# Altium project Prj_PLC_Hieu.PrjPcb
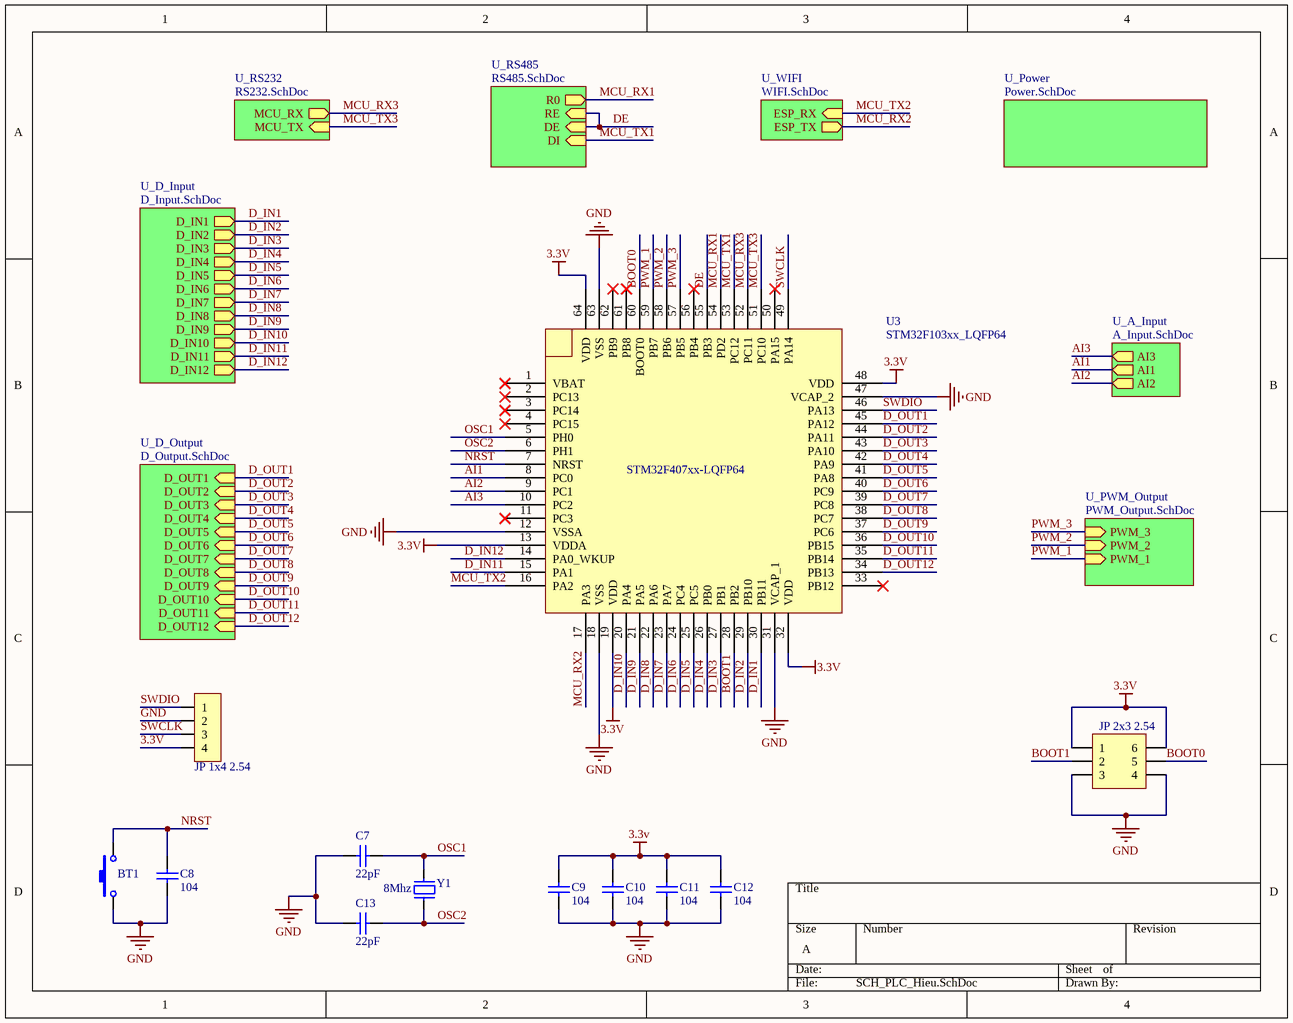
[diagram p0: SCH_PLC_Hieu.SchDoc]
7 sheets, 161 parts. Net scope: hierarchical (ports join the sheet entries above them; power ports are global).
Board file: PCB1.PcbDoc
Sheets:
  SCH_PLC_Hieu.SchDoc
    U_D_Input = D_Input.SchDoc
    U_D_Output = D_Output.SchDoc
    U_RS232 = RS232.SchDoc
    U_RS485 = RS485.SchDoc
    U_Power = Power.SchDoc
    U_PWM_Output = PWM_Output.SchDoc

## Sheet SCH_PLC_Hieu.SchDoc
size A; SheetNumber: 1; SheetTotal: 9

### Parts
BT1  Nut Nhan 2 Chan SMD 3x6x2.5  [Nut Nhan 2 Chan SMD 3x6x2.5]  (value not drawn)
C7  22pF  [tu 0805]
C8  104  [tu 0805]
C9  104  [tu 0805]
C10  104  [tu 0805]
C11  104  [tu 0805]
C12  104  [tu 0805]
C13  22pF  [tu 0805]
JP1  JP 2x3 2.54  [JP 2x3 DT]
JP2  JP 1x4 2.54  [JP 1x4 DT]
U3  STM32F103xx_LQFP64  [STM32_LQFP64]
Y1  8Mhz  [Thach Anh 2 chan SMD]

### Sub-sheets
U_A_Input = A_Input.SchDoc (file not in this document): AI3 (out), AI1 (out), AI2 (out)
U_D_Input = D_Input.SchDoc: D_IN12 (out), D_IN7 (out), D_IN4 (out), D_IN2 (out), D_IN9 (out), D_IN8 (out), D_IN11 (out), D_IN3 (out), D_IN5 (out), D_IN1 (out), D_IN10 (out), D_IN6 (out)
U_D_Output = D_Output.SchDoc: D_OUT9 (in), D_OUT8 (in), D_OUT4 (in), D_OUT7 (in), D_OUT12 (in), D_OUT5 (in), D_OUT2 (in), D_OUT11 (in), D_OUT10 (in), D_OUT6 (in), D_OUT1 (in), D_OUT3 (in)
U_Power = Power.SchDoc: no entries
U_PWM_Output = PWM_Output.SchDoc: PWM_3 (in), PWM_2 (in), PWM_1 (in)
U_RS232 = RS232.SchDoc: MCU_RX (out), MCU_TX (in)
U_RS485 = RS485.SchDoc: R0 (out), RE (in), DE (in), DI (in)
U_WIFI = WIFI.SchDoc (file not in this document): ESP_TX (out), ESP_RX (in)

### Nets
3.3V: C9.2 C10.2 C11.1 C12.2 JP1.1 JP1.6 JP2.4 U3.13(VDDA) U3.19(VDD) U3.32(VDD) U3.48(VDD) U3.64(VDD)
GND: BT1.1 C7.1 C8.2 C9.1 C10.1 C11.2 C12.1 C13.1 JP1.3 JP1.4 JP2.2 U3.12(VSSA) U3.18(VSS) U3.31(VCAP_1) U3.47(VCAP_2) U3.63(VSS)
AI1: U3.8(PC0) ; sheet U_A_Input/AI1
AI2: U3.9(PC1) ; sheet U_A_Input/AI2
AI3: U3.10(PC2) ; sheet U_A_Input/AI3
BOOT0: JP1.5 U3.60(BOOT0)
BOOT1: JP1.2 U3.28(PB2)
D_IN1: U3.30(PB11) ; sheet U_D_Input/D_IN1
D_IN2: U3.29(PB10) ; sheet U_D_Input/D_IN2
D_IN3: U3.27(PB1) ; sheet U_D_Input/D_IN3
D_IN4: U3.26(PB0) ; sheet U_D_Input/D_IN4
D_IN5: U3.25(PC5) ; sheet U_D_Input/D_IN5
D_IN6: U3.24(PC4) ; sheet U_D_Input/D_IN6
D_IN7: U3.23(PA7) ; sheet U_D_Input/D_IN7
D_IN8: U3.22(PA6) ; sheet U_D_Input/D_IN8
D_IN9: U3.21(PA5) ; sheet U_D_Input/D_IN9
D_IN10: U3.20(PA4) ; sheet U_D_Input/D_IN10
D_IN11: U3.15(PA1) ; sheet U_D_Input/D_IN11
D_IN12: U3.14(PA0_WKUP) ; sheet U_D_Input/D_IN12
D_OUT1: U3.45(PA12) ; sheet U_D_Output/D_OUT1
D_OUT2: U3.44(PA11) ; sheet U_D_Output/D_OUT2
D_OUT3: U3.43(PA10) ; sheet U_D_Output/D_OUT3
D_OUT4: U3.42(PA9) ; sheet U_D_Output/D_OUT4
D_OUT5: U3.41(PA8) ; sheet U_D_Output/D_OUT5
D_OUT6: U3.40(PC9) ; sheet U_D_Output/D_OUT6
D_OUT7: U3.39(PC8) ; sheet U_D_Output/D_OUT7
D_OUT8: U3.38(PC7) ; sheet U_D_Output/D_OUT8
D_OUT9: U3.37(PC6) ; sheet U_D_Output/D_OUT9
D_OUT10: U3.36(PB15) ; sheet U_D_Output/D_OUT10
D_OUT11: U3.35(PB14) ; sheet U_D_Output/D_OUT11
D_OUT12: U3.34(PB13) ; sheet U_D_Output/D_OUT12
DE: U3.55(PB3) ; sheet U_RS485/RE, sheet U_RS485/DE
MCU_RX1: U3.54(PD2) ; sheet U_RS485/R0
MCU_RX2: U3.17(PA3) ; sheet U_WIFI/ESP_TX
MCU_RX3: U3.52(PC11) ; sheet U_RS232/MCU_RX
MCU_TX1: U3.53(PC12) ; sheet U_RS485/DI
MCU_TX2: U3.16(PA2) ; sheet U_WIFI/ESP_RX
MCU_TX3: U3.51(PC10) ; sheet U_RS232/MCU_TX
NRST: BT1.2 C8.1 U3.7(NRST)
OSC1: C7.2 U3.5(PH0) Y1.2
OSC2: C13.2 U3.6(PH1) Y1.1
PWM_1: U3.59(PB7) ; sheet U_PWM_Output/PWM_1
PWM_2: U3.58(PB6) ; sheet U_PWM_Output/PWM_2
PWM_3: U3.57(PB5) ; sheet U_PWM_Output/PWM_3
SWCLK: JP2.3 U3.49(PA14)
SWDIO: JP2.1 U3.46(PA13)

Not connected (* = marked no-connect by the designer): U3 1(VBAT)* 2(PC13)* 3(PC14)* 4(PC15)* 11(PC3)* 33(PB12)* 50(PA15)* 56(PB4)* 61(PB8)* 62(PB9)*

### Notes on the sheet
- (in symbol STM32F103xx_LQFP64) STM32F407xx-LQFP64

### Library data of the parts
BT1 = Nut Nhan 2 Chan SMD 3x6x2.5: Ma_Hang: MH001036; Ten: Nút Nhấn 2 Chân 3x6x2.5MM SMD
C7 C13 = Tu 0805 22pF 50V 10%: Dán; Don_Vi: Con; So_Chan: 2; Ten_Linh_Kien: Tụ 0805 22P 10% 50V; Ma_Hang: MH004560; Chung_Loai: Dán; Kieu_Chan: *
C8-C12 = Tu 0805 104 50V 10%: Dán; Don_Vi: Con; So_Chan: 2; Ten_Linh_Kien: Tụ 0805 104-100nF 10% 50V; Ma_Hang: MH004551; Chung_Loai: Dán; Kieu_Chan: *
JP1 = JP 2x3 2.54 Duc Thang: Cắm; Ten_Linh_Kien: Jump Đôi Đực 2.54MM 2x40P Thẳng 11MM; Don_Vi: Con; Ma_Hang: MH002686; Ghi_Chu: *; Kieu_Chan: *; Chung_Loai: Cắm
JP2 = JP 1x4 2.54 Duc Thang: Cắm; Ten_Linh_Kien: Jump Đơn Đực 2.54MM 1x40P Thẳng 11MM; Don_Vi: Con; Ma_Hang: MH000903; Ghi_Chu: *; Kieu_Chan: *; Chung_Loai: Cắm
Y1 = Thach Anh 2 chan SMD: Crystal For all Crystal 2pin.; Value: 4Mhz

## Sheet D_Input.SchDoc
size A; SheetNumber: 4; SheetTotal: 9
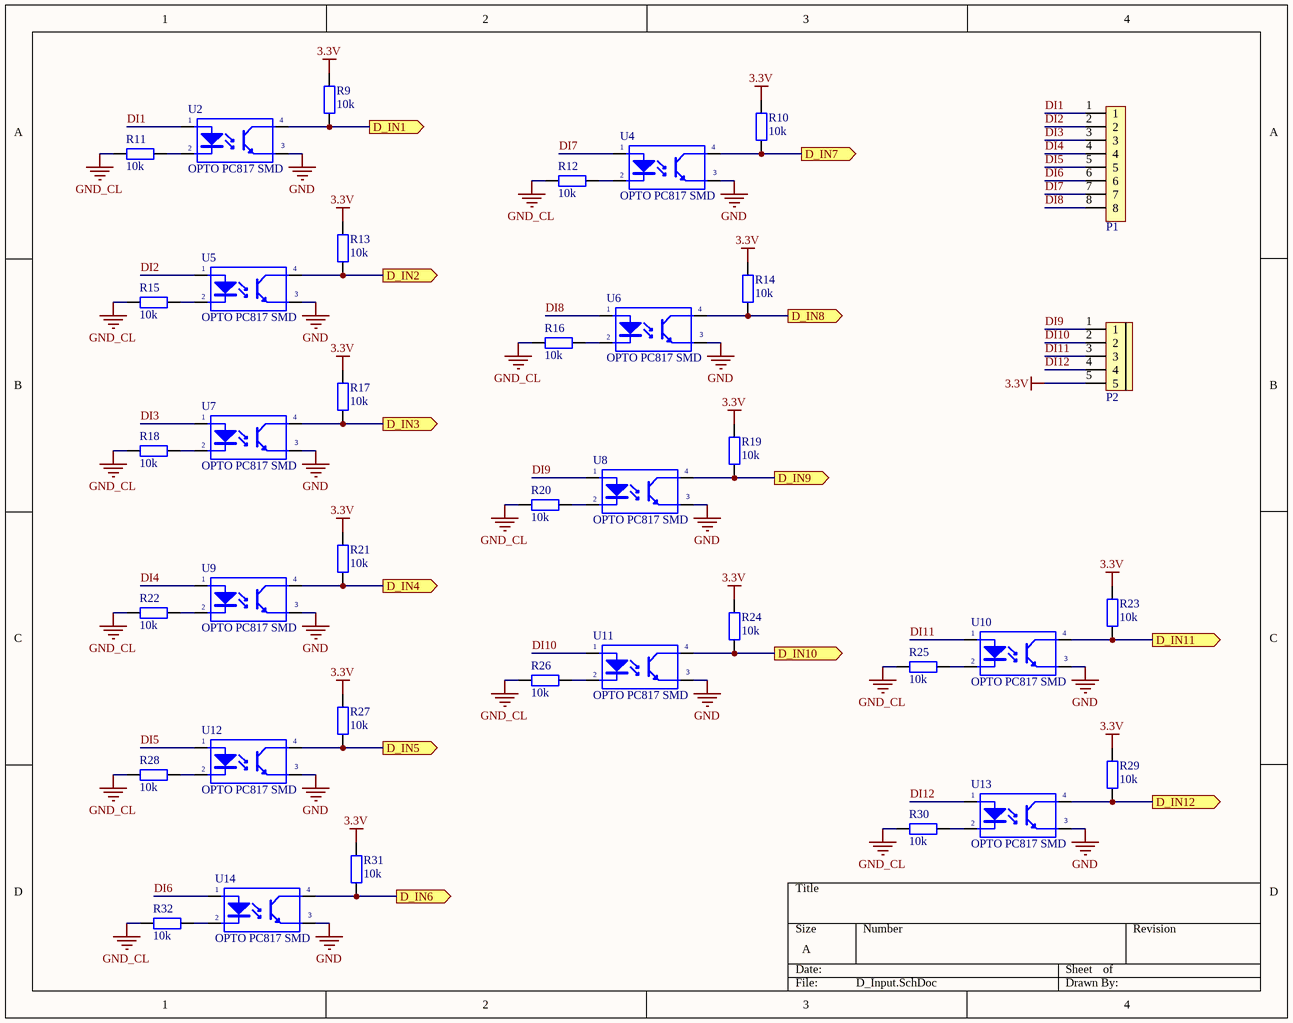
[diagram p1: D_Input.SchDoc]

### Parts
P1  CON 8 EDG5.08  [CON 8 8EDG5.08]  (value not drawn)
P2  CON 5 EDG5.08  [CON 5 5EDG5.08]  (value not drawn)
R9  10k  [tro smd 0805]
R10  10k  [tro smd 0805]
R11  10k  [tro smd 0805]
R12  10k  [tro smd 0805]
R13  10k  [tro smd 0805]
R14  10k  [tro smd 0805]
R15  10k  [tro smd 0805]
R16  10k  [tro smd 0805]
R17  10k  [tro smd 0805]
R18  10k  [tro smd 0805]
R19  10k  [tro smd 0805]
R20  10k  [tro smd 0805]
R21  10k  [tro smd 0805]
R22  10k  [tro smd 0805]
R23  10k  [tro smd 0805]
R24  10k  [tro smd 0805]
R25  10k  [tro smd 0805]
R26  10k  [tro smd 0805]
R27  10k  [tro smd 0805]
R28  10k  [tro smd 0805]
R29  10k  [tro smd 0805]
R30  10k  [tro smd 0805]
R31  10k  [tro smd 0805]
R32  10k  [tro smd 0805]
U2  OPTO PC817 SMD  [SOP4]
U4  OPTO PC817 SMD  [SOP4]
U5  OPTO PC817 SMD  [SOP4]
U6  OPTO PC817 SMD  [SOP4]
U7  OPTO PC817 SMD  [SOP4]
U8  OPTO PC817 SMD  [SOP4]
U9  OPTO PC817 SMD  [SOP4]
U10  OPTO PC817 SMD  [SOP4]
U11  OPTO PC817 SMD  [SOP4]
U12  OPTO PC817 SMD  [SOP4]
U13  OPTO PC817 SMD  [SOP4]
U14  OPTO PC817 SMD  [SOP4]

### Ports
D_IN1 (out), D_IN2 (out), D_IN3 (out), D_IN4 (out), D_IN5 (out), D_IN6 (out), D_IN7 (out), D_IN8 (out), D_IN9 (out), D_IN10 (out), D_IN11 (out), D_IN12 (out)

### Nets
3.3V: P2.5 R9.2 R10.2 R13.2 R14.2 R17.2 R19.2 R21.2 R23.2 R24.2 R27.2 R29.2 R31.2
GND: U2.3(E) U4.3(E) U5.3(E) U6.3(E) U7.3(E) U8.3(E) U9.3(E) U10.3(E) U11.3(E) U12.3(E) U13.3(E) U14.3(E)
GND_CL: R11.1 R12.1 R15.1 R16.1 R18.1 R20.1 R22.1 R25.1 R26.1 R28.1 R30.1 R32.1
D_IN1: R9.1 U2.4(C) ; port D_IN1
D_IN2: R13.1 U5.4(C) ; port D_IN2
D_IN3: R17.1 U7.4(C) ; port D_IN3
D_IN4: R21.1 U9.4(C) ; port D_IN4
D_IN5: R27.1 U12.4(C) ; port D_IN5
D_IN6: R31.1 U14.4(C) ; port D_IN6
D_IN7: R10.1 U4.4(C) ; port D_IN7
D_IN8: R14.1 U6.4(C) ; port D_IN8
D_IN9: R19.1 U8.4(C) ; port D_IN9
D_IN10: R24.1 U11.4(C) ; port D_IN10
D_IN11: R23.1 U10.4(C) ; port D_IN11
D_IN12: R29.1 U13.4(C) ; port D_IN12
DI1: P1.1 U2.1(A)
DI2: P1.2 U5.1(A)
DI3: P1.3 U7.1(A)
DI4: P1.4 U9.1(A)
DI5: P1.5 U12.1(A)
DI6: P1.6 U14.1(A)
DI7: P1.7 U4.1(A)
DI8: P1.8 U6.1(A)
DI9: P2.1 U8.1(A)
DI10: P2.2 U11.1(A)
DI11: P2.3 U10.1(A)
DI12: P2.4 U13.1(A)
NetR11_2: R11.2 U2.2(K)
NetR12_2: R12.2 U4.2(K)
NetR15_2: R15.2 U5.2(K)
NetR16_2: R16.2 U6.2(K)
NetR18_2: R18.2 U7.2(K)
NetR20_2: R20.2 U8.2(K)
NetR22_2: R22.2 U9.2(K)
NetR25_2: R25.2 U10.2(K)
NetR26_2: R26.2 U11.2(K)
NetR28_2: R28.2 U12.2(K)
NetR30_2: R30.2 U13.2(K)
NetR32_2: R32.2 U14.2(K)

### Library data of the parts
P1 = CON 8 EDG5.08: Cắm; Ten_Linh_Kien: CON 8 2EDG5.08-8P 5.08MM ( Xanh Cong); Ma_Hang: MH000978; Don_Vi: Con; Ghi_Chu: *; Kieu_Chan: *; Chung_Loai: Cắm
P2 = CON 5 EDG5.08: Cắm; Ten_Linh_Kien: CON 5 2EDG5.08-5P 5.08MM ( Xanh Cong); Ma_Hang: MH003589; Kieu_Chan: *; Don_Vi: Con; Ghi_Chu: *; Chung_Loai: Cắm
R9-R32 = Tro 0805 1% 10k: Dán; Don_Vi: Con; So_Chan: 2; Ten_Linh_Kien: Trở 0805 1% 10k; Ma_Hang: MH005473; Chung_Loai: Dán; Kieu_Chan: *
U2 U4-U14 = OPTO PC817 SMD: Single Opto; Value: PC817

## Sheet D_Output.SchDoc
size B; SheetNumber: 6; SheetTotal: 9
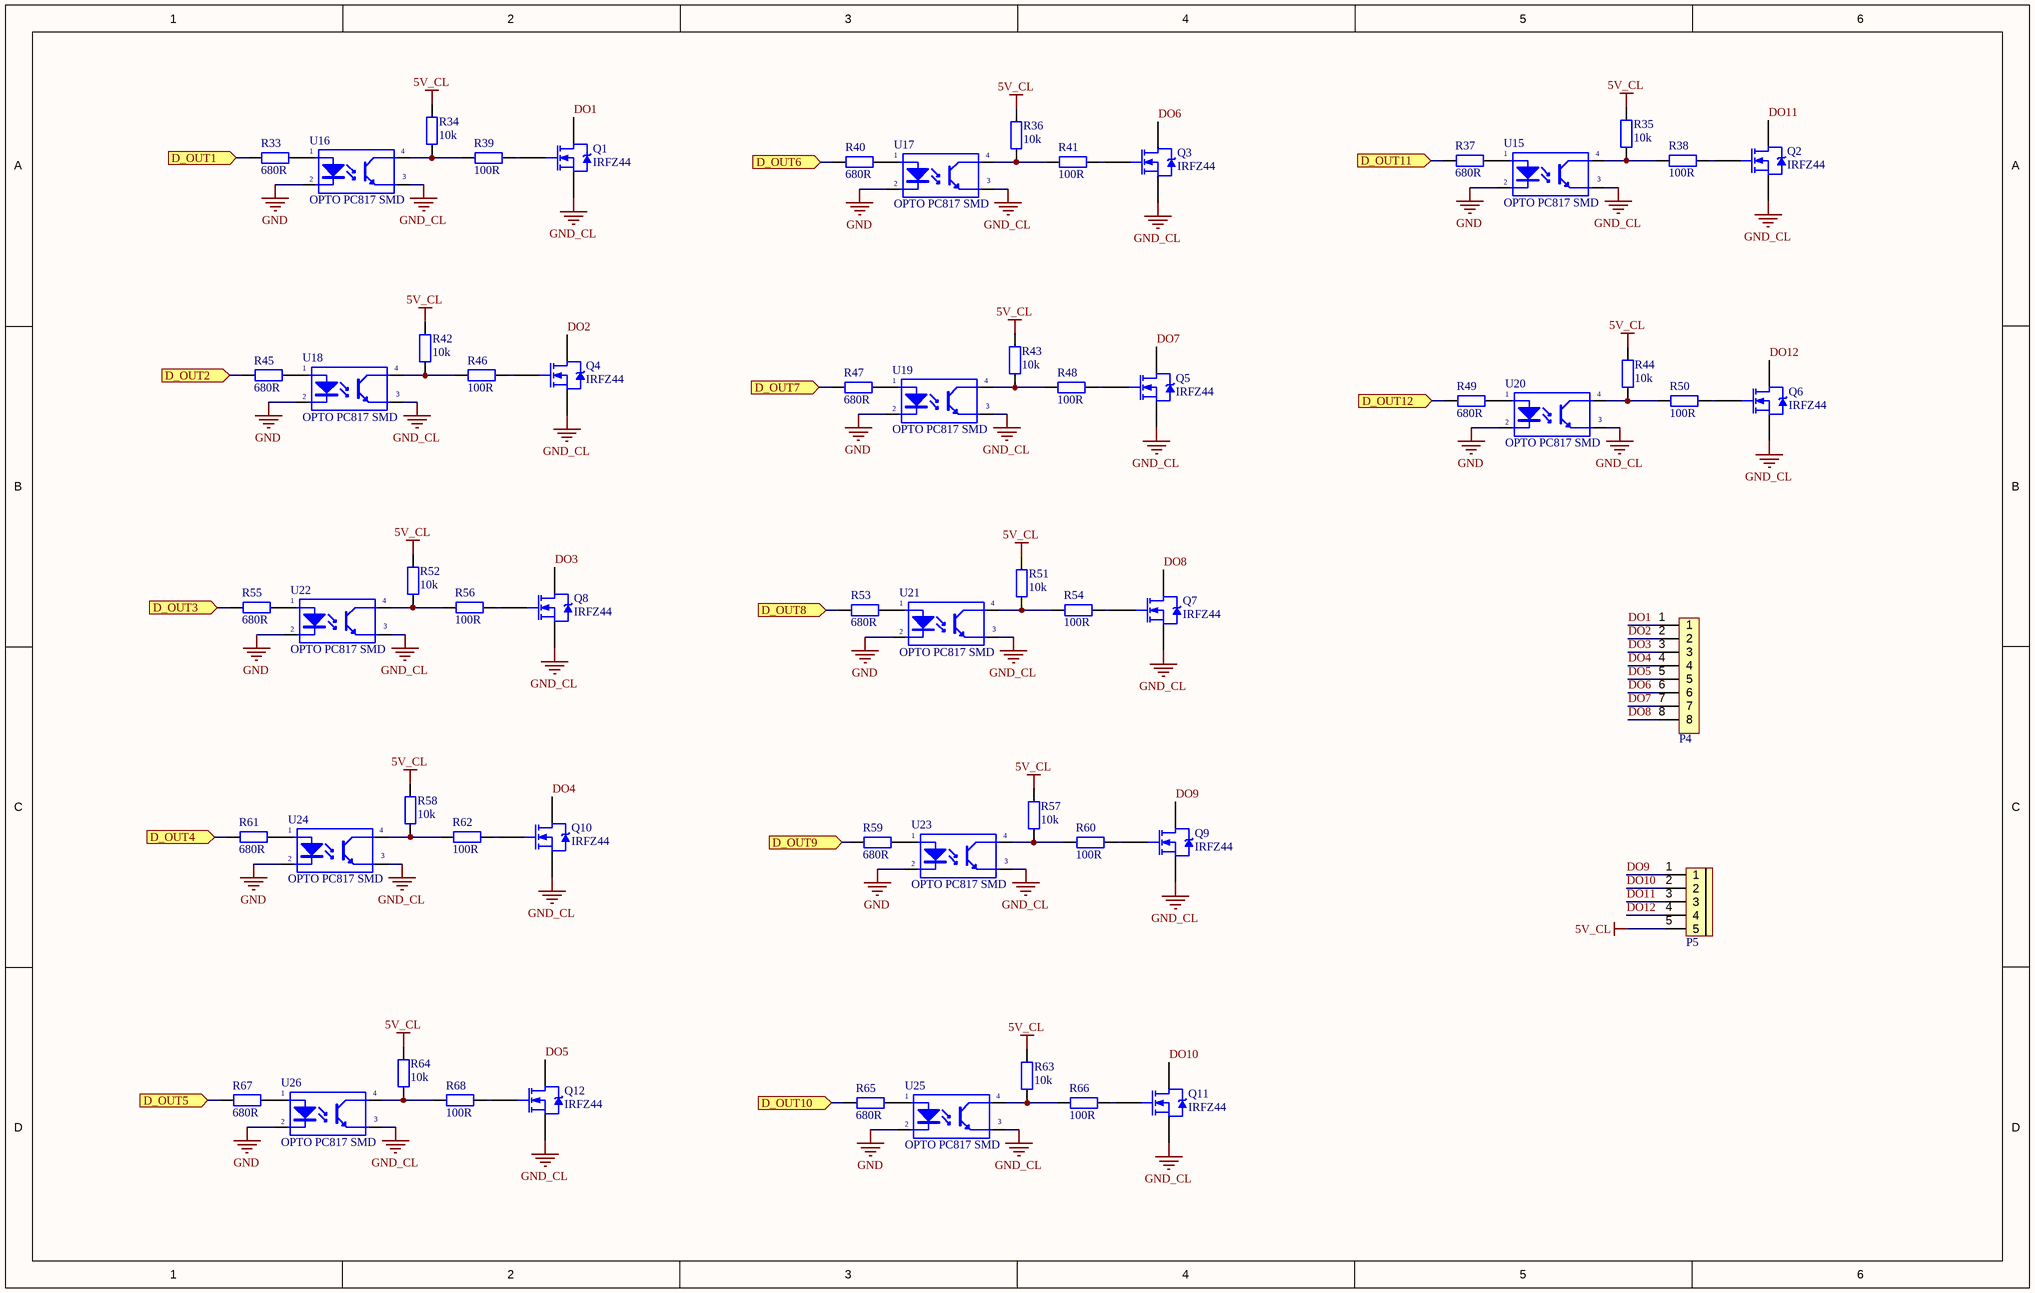
[diagram p2: D_Output.SchDoc]

### Parts
P4  CON 8 EDG5.08  [CON 8 8EDG5.08]  (value not drawn)
P5  CON 5 EDG5.08  [CON 5 5EDG5.08]  (value not drawn)
Q1  IRFZ44  [TO220]
Q2  IRFZ44  [TO220]
Q3  IRFZ44  [TO220]
Q4  IRFZ44  [TO220]
Q5  IRFZ44  [TO220]
Q6  IRFZ44  [TO220]
Q7  IRFZ44  [TO220]
Q8  IRFZ44  [TO220]
Q9  IRFZ44  [TO220]
Q10  IRFZ44  [TO220]
Q11  IRFZ44  [TO220]
Q12  IRFZ44  [TO220]
R33  680R  [tro smd 0805]
R34  10k  [tro smd 0805]
R35  10k  [tro smd 0805]
R36  10k  [tro smd 0805]
R37  680R  [tro smd 0805]
R38  100R  [tro smd 0805]
R39  100R  [tro smd 0805]
R40  680R  [tro smd 0805]
R41  100R  [tro smd 0805]
R42  10k  [tro smd 0805]
R43  10k  [tro smd 0805]
R44  10k  [tro smd 0805]
R45  680R  [tro smd 0805]
R46  100R  [tro smd 0805]
R47  680R  [tro smd 0805]
R48  100R  [tro smd 0805]
R49  680R  [tro smd 0805]
R50  100R  [tro smd 0805]
R51  10k  [tro smd 0805]
R52  10k  [tro smd 0805]
R53  680R  [tro smd 0805]
R54  100R  [tro smd 0805]
R55  680R  [tro smd 0805]
R56  100R  [tro smd 0805]
R57  10k  [tro smd 0805]
R58  10k  [tro smd 0805]
R59  680R  [tro smd 0805]
R60  100R  [tro smd 0805]
R61  680R  [tro smd 0805]
R62  100R  [tro smd 0805]
R63  10k  [tro smd 0805]
R64  10k  [tro smd 0805]
R65  680R  [tro smd 0805]
R66  100R  [tro smd 0805]
R67  680R  [tro smd 0805]
R68  100R  [tro smd 0805]
U15  OPTO PC817 SMD  [SOP4]
U16  OPTO PC817 SMD  [SOP4]
U17  OPTO PC817 SMD  [SOP4]
U18  OPTO PC817 SMD  [SOP4]
U19  OPTO PC817 SMD  [SOP4]
U20  OPTO PC817 SMD  [SOP4]
U21  OPTO PC817 SMD  [SOP4]
U22  OPTO PC817 SMD  [SOP4]
U23  OPTO PC817 SMD  [SOP4]
U24  OPTO PC817 SMD  [SOP4]
U25  OPTO PC817 SMD  [SOP4]
U26  OPTO PC817 SMD  [SOP4]

### Ports
D_OUT1 (in), D_OUT2 (in), D_OUT3 (in), D_OUT4 (in), D_OUT5 (in), D_OUT6 (in), D_OUT7 (in), D_OUT8 (in), D_OUT9 (in), D_OUT10 (in), D_OUT11 (in), D_OUT12 (in)

### Nets
5V_CL: P5.5 R34.1 R35.1 R36.1 R42.1 R43.1 R44.1 R51.1 R52.1 R57.1 R58.1 R63.1 R64.1
GND: U15.2(K) U16.2(K) U17.2(K) U18.2(K) U19.2(K) U20.2(K) U21.2(K) U22.2(K) U23.2(K) U24.2(K) U25.2(K) U26.2(K)
GND_CL: Q1.3(S) Q2.3(S) Q3.3(S) Q4.3(S) Q5.3(S) Q6.3(S) Q7.3(S) Q8.3(S) Q9.3(S) Q10.3(S) Q11.3(S) Q12.3(S) U15.3(E) U16.3(E) U17.3(E) U18.3(E) U19.3(E) U20.3(E) U21.3(E) U22.3(E) U23.3(E) U24.3(E) U25.3(E) U26.3(E)
D_OUT1: R33.1 ; port D_OUT1
D_OUT2: R45.1 ; port D_OUT2
D_OUT3: R55.1 ; port D_OUT3
D_OUT4: R61.1 ; port D_OUT4
D_OUT5: R67.1 ; port D_OUT5
D_OUT6: R40.1 ; port D_OUT6
D_OUT7: R47.1 ; port D_OUT7
D_OUT8: R53.1 ; port D_OUT8
D_OUT9: R59.1 ; port D_OUT9
D_OUT10: R65.1 ; port D_OUT10
D_OUT11: R37.1 ; port D_OUT11
D_OUT12: R49.1 ; port D_OUT12
DO1: P4.1 Q1.2(D)
DO2: P4.2 Q4.2(D)
DO3: P4.3 Q8.2(D)
DO4: P4.4 Q10.2(D)
DO5: P4.5 Q12.2(D)
DO6: P4.6 Q3.2(D)
DO7: P4.7 Q5.2(D)
DO8: P4.8 Q7.2(D)
DO9: P5.1 Q9.2(D)
DO10: P5.2 Q11.2(D)
DO11: P5.3 Q2.2(D)
DO12: P5.4 Q6.2(D)
NetQ1_1: Q1.1(G) R39.2
NetQ2_1: Q2.1(G) R38.2
NetQ3_1: Q3.1(G) R41.2
NetQ4_1: Q4.1(G) R46.2
NetQ5_1: Q5.1(G) R48.2
NetQ6_1: Q6.1(G) R50.2
NetQ7_1: Q7.1(G) R54.2
NetQ8_1: Q8.1(G) R56.2
NetQ9_1: Q9.1(G) R60.2
NetQ10_1: Q10.1(G) R62.2
NetQ11_1: Q11.1(G) R66.2
NetQ12_1: Q12.1(G) R68.2
NetR33_2: R33.2 U16.1(A)
NetR34_2: R34.2 R39.1 U16.4(C)
NetR35_2: R35.2 R38.1 U15.4(C)
NetR36_2: R36.2 R41.1 U17.4(C)
NetR37_2: R37.2 U15.1(A)
NetR40_2: R40.2 U17.1(A)
NetR42_2: R42.2 R46.1 U18.4(C)
NetR43_2: R43.2 R48.1 U19.4(C)
NetR44_2: R44.2 R50.1 U20.4(C)
NetR45_2: R45.2 U18.1(A)
NetR47_2: R47.2 U19.1(A)
NetR49_2: R49.2 U20.1(A)
NetR51_2: R51.2 R54.1 U21.4(C)
NetR52_2: R52.2 R56.1 U22.4(C)
NetR53_2: R53.2 U21.1(A)
NetR55_2: R55.2 U22.1(A)
NetR57_2: R57.2 R60.1 U23.4(C)
NetR58_2: R58.2 R62.1 U24.4(C)
NetR59_2: R59.2 U23.1(A)
NetR61_2: R61.2 U24.1(A)
NetR63_2: R63.2 R66.1 U25.4(C)
NetR64_2: R64.2 R68.1 U26.4(C)
NetR65_2: R65.2 U25.1(A)
NetR67_2: R67.2 U26.1(A)

### Notes on the sheet
- DWG. NO.
- REV.
- SHT.
- REVISION
- DESCRIPTION
- DATE
- APPROVED
- THIS DOCUMENT AND THE DATA DISCLOSED HEREIN OR HEREWITH IS THE PROPERTY OF ALTIUM LIMITED AND MAY BE FREELY DISTRIBUTED IN WHOLE. NO RIGHTS ARE RESERVED OR EXPRESS OR IMPLIED WARANTEE GIVEN.
- ENG:
- DSN:
- APPROVALS
- PROJECT
- DOCUMENT REVISION:
- DESIGN ITEM:
- CHK:
- BOM:
- REFERENCE DOCUMENTS
- PROJECT REVISION:
- TITLE
- FAB DWG:
- PCB DWG:
- ASSY DWG:
- SCALE:
- SIZE
- C
- CAGE CODE
- FILE NAME
- DWG NO.
- SHEET
- OF
- REV

### Library data of the parts
P4 = CON 8 EDG5.08: as P1 on sheet D_Input; Don_Vi: Con; Ghi_Chu: *; Kieu_Chan: *; Chung_Loai: Cắm
P5 = CON 5 EDG5.08: as P2 on sheet D_Input; Kieu_Chan: *; Don_Vi: Con; Ghi_Chu: *; Chung_Loai: Cắm
Q1-Q12 = IRFZ44 DIP: N-Channel Power MOSFET
R33 R37 R40 R45 R47 R49 R53 R55 R59 R61 R65 R67 = Tro 0805 1% 680R: Dán; Don_Vi: Con; So_Chan: 2; Ten_Linh_Kien: Trở 0805 1% 680R; Ma_Hang: MH005487; Chung_Loai: Dán; Kieu_Chan: *
R34-R36 R42-R44 R51 R52 R57 R58 R63 R64 = Tro 0805 1% 10k: as R9 on sheet D_Input; Chung_Loai: Dán; Kieu_Chan: *
R38 R39 R41 R46 R48 R50 R54 R56 R60 R62 R66 R68 = Tro 0805 5% 100R: Dán; Don_Vi: Con; So_Chan: 2; Ten_Linh_Kien: Trở 0805 5% 100R; Ma_Hang: MH005251; Chung_Loai: Dán; Kieu_Chan: *
U15-U26 = OPTO PC817 SMD: Single Opto; Value: PC817

## Sheet RS232.SchDoc
size A; SheetNumber: 2; SheetTotal: 9
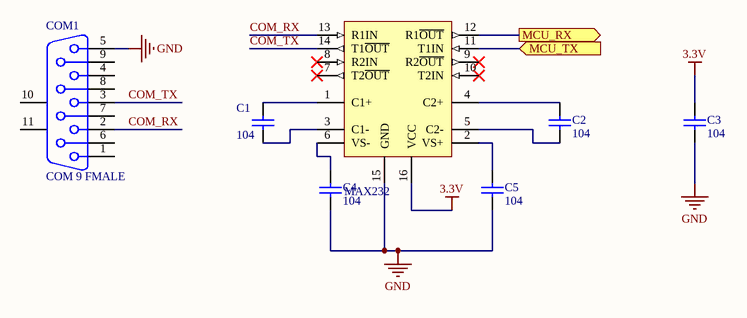
[diagram p3: RS232.SchDoc]

### Parts
C1  104  [tu 0805]
C2  104  [tu 0805]
C3  104  [tu 0805]
C4  104  [tu 0805]
C5  104  [tu 0805]
COM1  COM 9 FMALE  [DSB 9-F]
IC1  MAX232  [DIP16/W0.3]

### Ports
MCU_RX (out), MCU_TX (in)

### Nets
3.3V: C3.1 IC1.16(VCC)
GND: C3.2 C4.2 C5.2 COM1.5 IC1.15(GND)
COM_RX: COM1.2 IC1.13(R1IN)
COM_TX: COM1.3 IC1.14(T1~{OUT})
MCU_RX3: IC1.12(R1~{OUT}) ; port MCU_RX
MCU_TX3: IC1.11(T1IN) ; port MCU_TX
NetC1_1: C1.1 IC1.1(C1+)
NetC1_2: C1.2 IC1.3(C1-)
NetC2_1: C2.1 IC1.4(C2+)
NetC2_2: C2.2 IC1.5(C2-)
NetC4_1: C4.1 IC1.6(VS-)
NetC5_1: C5.1 IC1.2(VS+)

Not connected (* = marked no-connect by the designer): COM1 1 4 6 7 8 9 10(MH1) 11(MH2); IC1 7(T2~{OUT})* 8(R2IN)* 9(R2~{OUT})* 10(T2IN)*

### Library data of the parts
C1-C5 = Tu 0805 104 50V 10%: as C8 on sheet SCH_PLC_Hieu; Chung_Loai: Dán; Kieu_Chan: *
COM1 = DSB9F: COM 9; PackageDocument: O; Positions: 9; Gender: Receptacle; Value: COM 9; Published: 15-Jun-2001; LatestRevisionDate: 17-Jul-2002; LatestRevisionNote: Re-released for DXP Platform.; DatasheetDocument: 1-Sep-1999; PackageReference: 788750; Publisher: Altium Limited; Orientation: Right Angle
IC1 = MAX232: Dual EIA-232 Driver/Receiver; Value: MAX232

## Sheet RS485.SchDoc
size A; SheetNumber: 3; SheetTotal: 9
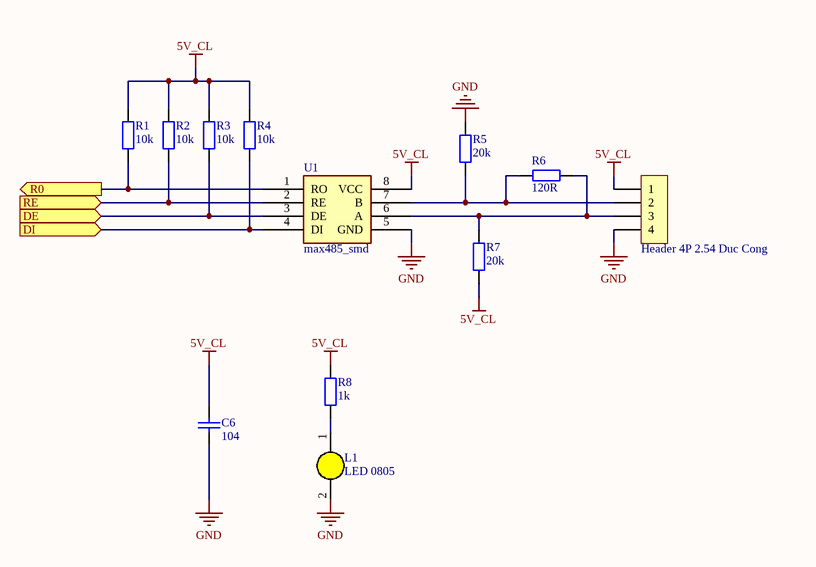
[diagram p4: RS485.SchDoc]

### Parts
C6  104  [tu 0805]
H1  Header 4P 2.54 Duc Cong  [Header 4P DC 2.54]
L1  LED 0805  [LED-0805-Yellow]
R1  10k  [tro smd 0805]
R2  10k  [tro smd 0805]
R3  10k  [tro smd 0805]
R4  10k  [tro smd 0805]
R5  20k  [tro smd 0805]
R6  120R  [tro smd 0805]
R7  20k  [tro smd 0805]
R8  1k  [tro smd 0805]
U1  max485_smd  [DIP8/W0.3]

### Ports
DE (in), DI (in), R0 (out), RE (in)

### Nets
5V_CL: C6.2 H1.1 R1.2 R2.2 R3.2 R4.2 R7.2 R8.2 U1.8(VCC)
GND: C6.1 H1.4 L1.2(K) R5.2 U1.5(GND)
DE: R2.1 R3.1 U1.2(RE) U1.3(DE) ; port RE, port DE
MCU_RX1: R1.1 U1.1(RO) ; port R0
MCU_TX1: R4.1 U1.4(DI) ; port DI
NetH1_2: H1.2 R5.1 R6.1 U1.7(B)
NetH1_3: H1.3 R6.2 R7.1 U1.6(A)
NetL1_1: L1.1(A) R8.1

### Library data of the parts
C6 = Tu 0805 104 50V 10%: as C8 on sheet SCH_PLC_Hieu; Chung_Loai: Dán; Kieu_Chan: *
H1 = Header 4P 2.54 Duc Cong: Cắm; Ten_Linh_Kien: Header 4P XH2.54-4P Đực Cong; Don_Vi: Con; Ma_Hang: MH001310; Chung_Loai: Cắm
L1 = LED 0805 Vang: Dán; Don_Vi: Con; Ma_Hang: MH002329; Ten_Linh_Kien: LED 0805 Màu Vàng ( Yellow); Ghi_Chu: *; Kieu_Chan: *; Chung_Loai: Dán
R1-R4 = Tro 0805 1% 10k: as R9 on sheet D_Input; Chung_Loai: Dán; Kieu_Chan: *
R5 R7 = Tro 0805 5% 20k: Dán; Don_Vi: Con; So_Chan: 2; Ten_Linh_Kien: Trở 0805 5% 20k; Ma_Hang: MH005247; Chung_Loai: Dán; Kieu_Chan: *
R6 = Tro 0805 5% 120R: Dán; Don_Vi: Con; So_Chan: 2; Ten_Linh_Kien: Trở 0805 5% 120R; Ma_Hang: MH005253; Chung_Loai: Dán; Kieu_Chan: *
R8 = Tro 0805 1% 1k: Dán; Don_Vi: Con; So_Chan: 2; Ten_Linh_Kien: Trở 0805 1% 1k; Ma_Hang: MH005468; Chung_Loai: Dán; Kieu_Chan: *

## Sheet Power.SchDoc
size A; SheetNumber: 8; SheetTotal: 9
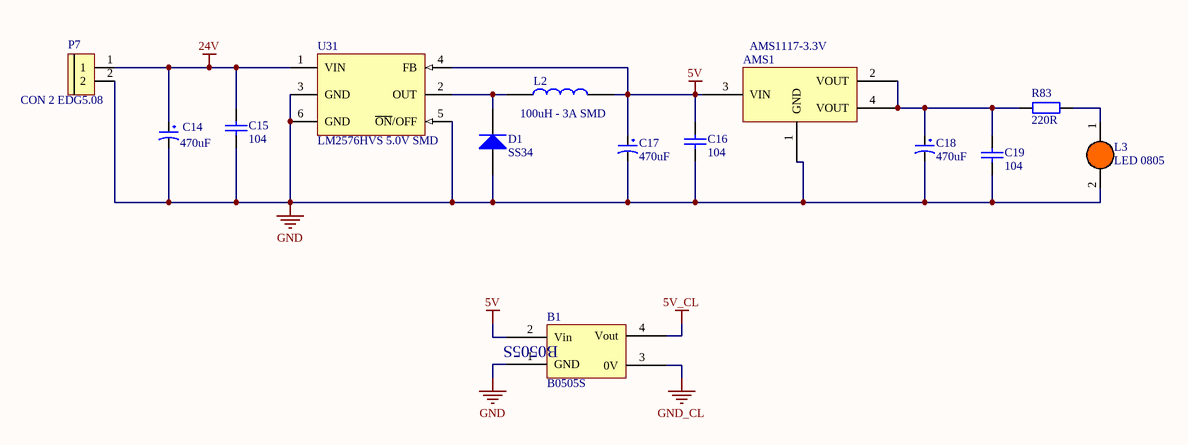
[diagram p5: Power.SchDoc]

### Parts
AMS1  AMS1117-3.3V  [SOT223]
B1  B0505S  [B0505S]
C14  470uF  [tu hoa 10mm]
C15  104  [tu 0805]
C16  104  [tu 0805]
C17  470uF  [tu hoa 8mm]
C18  470uF  [tu hoa 8mm]
C19  104  [tu 0805]
D1  SS34  [DIODE SMA]
L2  100uH - 3A SMD  [Cuon Cam 12x12x10]
L3  LED 0805  [LED-0805-Orange]
P7  CON 2 EDG5.08  [CON 2 2EDG5.08]
R83  220R  [tro smd 0805]
U31  LM2576HVS 5.0V SMD  [TO263-5]

### Nets
5V: AMS1.3(VIN) B1.2(Vin) C16.1 C17.1 L2.2 U31.4(FB)
5V_CL: B1.4(Vout)
24V: C14.1 C15.2 P7.1 U31.1(VIN)
GND: AMS1.1(GND) B1.1(GND) C14.2 C15.1 C16.2 C17.2 C18.2 C19.2 D1.1(A) L3.2(K) P7.2 U31.3(GND) U31.5(~{ON}/OFF) U31.6(GND)
GND_CL: B1.3(0V)
NetAMS1_2: AMS1.2(VOUT) AMS1.4(VOUT) C18.1 C19.1 R83.1
NetD1_2: D1.2(K) L2.1 U31.2(OUT)
NetL3_1: L3.1(A) R83.2

### Library data of the parts
AMS1 = AMS1117 SMD: Dán; Value: AMS1117-3.3V SOT223; Don_Vi: Con; Ma_Hang: MH000596; Ghi_Chu: *; Kieu_Chan: *; Chung_Loai: Dán
B1 = B0505S: Cắm; Ten_Linh_Kien: B0505S-1W SIP4 IC Converter DC-DC; Don_Vi: Con; Ma_Hang: MH003143; Ghi_Chu: *; Kieu_Chan: *; Chung_Loai: Cắm
C14 = Tu Hoa 470uF 50V 10x17: Cắm; Don_Vi: Con; So_Chan: 2; Ten_Linh_Kien: Tụ Hóa 470uF 50V; Ma_Hang: MH006866; Chung_Loai: Cắm; Kieu_Chan: *
C15 C16 C19 = Tu 0805 104 50V 10%: as C8 on sheet SCH_PLC_Hieu; Chung_Loai: Dán; Kieu_Chan: *
C17 C18 = Tu Hoa 470uF 16V 8x11: Cắm; Don_Vi: Con; So_Chan: 2; Ten_Linh_Kien: Tụ Hóa 470uF 16V 8x11MM; Ma_Hang: MH006550; Chung_Loai: Cắm; Kieu_Chan: *
D1 = Diode SS34 ( 1N5822 ): Dán; Don_Vi: Con; Ma_Hang: MH002104; Ten_Linh_Kien: Diode SS34 3A 40V SMA ( 1N5822 SS34A); Kieu_Chan: *; Chung_Loai: Dán
L2 = CUON CAM 100uH SMD: Dán; Don_Vi: Con; Ma_Hang: MH003999; Ten_Linh_Kien: Cuộn Cảm 100uH 7x7x4MM CD74; Ma_Hang: *; Kieu_Chan: *; Chung_Loai: Dán
L3 = LED 0805 Cam: Dán; Don_Vi: Con; Ma_Hang: MH002328; Ten_Linh_Kien: LED 0805 Màu Cam ( Orange); Ghi_Chu: *; Kieu_Chan: *; Chung_Loai: Dán
P7 = CON 2 EDG5.08: Cắm; Ten_Linh_Kien: CON 2 2EDG5.08-2P 5.08MM ( Xanh Cong); Ma_Hang: MH000759; Ghi_Chu: *; Don_Vi: Con; Kieu_Chan: *; Chung_Loai: Cắm
R83 = Tro 0805 5% 220R: Dán; Don_Vi: Con; So_Chan: 2; Ten_Linh_Kien: Trở 0805 5% 220R; Ma_Hang: MH005259; Chung_Loai: Dán; Kieu_Chan: *
U31 = LM2576HVS 5.0V SMD: Dán; Ten_Linh_Kien: LM2576HVS-5.0V BUCK 5V 3A TO263-5; Don_Vi: Con; Ma_Hang: MH002362; Ghi_Chu: *; Kieu_Chan: *; Chung_Loai: Dán

## Sheet PWM_Output.SchDoc
size A; SheetNumber: 9; SheetTotal: 9
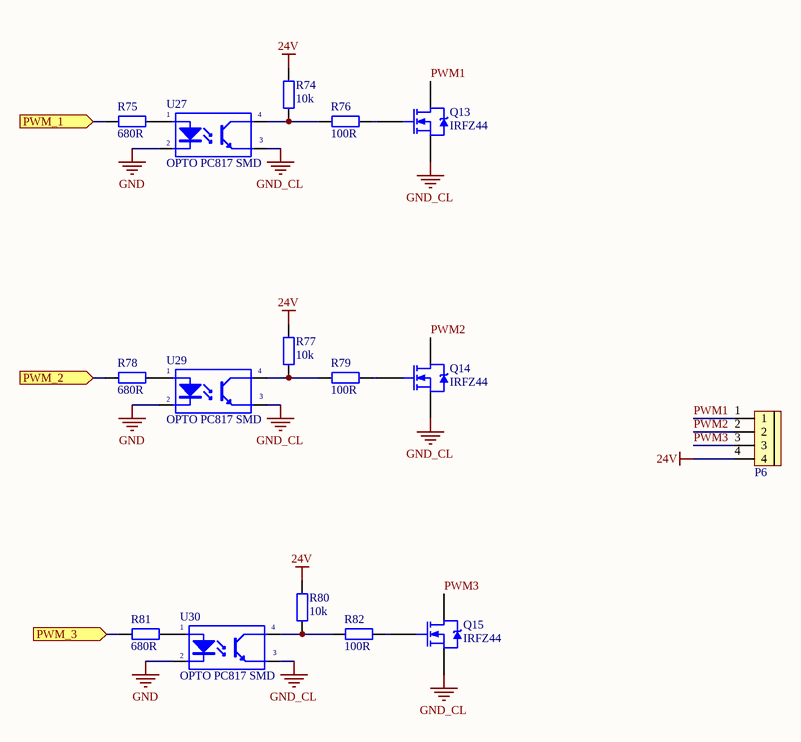
[diagram p6: PWM_Output.SchDoc]

### Parts
P6  CON 4 EDG5.08  [CON 4 4EDG5.08]  (value not drawn)
Q13  IRFZ44  [TO220]
Q14  IRFZ44  [TO220]
Q15  IRFZ44  [TO220]
R74  10k  [tro smd 0805]
R75  680R  [tro smd 0805]
R76  100R  [tro smd 0805]
R77  10k  [tro smd 0805]
R78  680R  [tro smd 0805]
R79  100R  [tro smd 0805]
R80  10k  [tro smd 0805]
R81  680R  [tro smd 0805]
R82  100R  [tro smd 0805]
U27  OPTO PC817 SMD  [SOP4]
U29  OPTO PC817 SMD  [SOP4]
U30  OPTO PC817 SMD  [SOP4]

### Ports
PWM_1 (in), PWM_2 (in), PWM_3 (in)

### Nets
24V: P6.4 R74.1 R77.1 R80.1
GND: U27.2(K) U29.2(K) U30.2(K)
GND_CL: Q13.3(S) Q14.3(S) Q15.3(S) U27.3(E) U29.3(E) U30.3(E)
PWM1: P6.1 Q13.2(D)
PWM2: P6.2 Q14.2(D)
PWM3: P6.3 Q15.2(D)
PWM_1: R75.1 ; port PWM_1
PWM_2: R78.1 ; port PWM_2
PWM_3: R81.1 ; port PWM_3
NetQ13_1: Q13.1(G) R76.2
NetQ14_1: Q14.1(G) R79.2
NetQ15_1: Q15.1(G) R82.2
NetR74_2: R74.2 R76.1 U27.4(C)
NetR75_2: R75.2 U27.1(A)
NetR77_2: R77.2 R79.1 U29.4(C)
NetR78_2: R78.2 U29.1(A)
NetR80_2: R80.2 R82.1 U30.4(C)
NetR81_2: R81.2 U30.1(A)

### Library data of the parts
P6 = CON 4 EDG5.08: Cắm; Ten_Linh_Kien: CON 4 2EDG5.08-4P 5.08MM ( Xanh Cong); Ma_Hang: MH000979; Don_Vi: Con; Ghi_Chu: *; Kieu_Chan: *; Chung_Loai: Cắm
Q13-Q15 = IRFZ44 DIP: N-Channel Power MOSFET
R74 R77 R80 = Tro 0805 1% 10k: as R9 on sheet D_Input; Chung_Loai: Dán; Kieu_Chan: *
R75 R78 R81 = Tro 0805 1% 680R: as R33 on sheet D_Output; Chung_Loai: Dán; Kieu_Chan: *
R76 R79 R82 = Tro 0805 5% 100R: as R38 on sheet D_Output; Chung_Loai: Dán; Kieu_Chan: *
U27 U29 U30 = OPTO PC817 SMD: Single Opto; Value: PC817

## Nets that join several sheets
3.3V: SCH_PLC_Hieu (12 pins), D_Input (13 pins), RS232 (C3.1 IC1.16)
5V_CL: D_Output (13 pins), RS485 (9 pins), Power (B1.4)
24V: Power (C14.1 C15.2 P7.1 U31.1), PWM_Output (P6.4 R74.1 R77.1 R80.1)
GND: SCH_PLC_Hieu (16 pins), D_Input (12 pins), D_Output (12 pins), RS232 (5 pins), RS485 (5 pins), Power (14 pins), PWM_Output (U27.2 U29.2 U30.2)
GND_CL: D_Input (12 pins), D_Output (24 pins), Power (B1.3), PWM_Output (6 pins)
D_IN1: SCH_PLC_Hieu (U3.30), D_Input (R9.1 U2.4)
D_IN2: SCH_PLC_Hieu (U3.29), D_Input (R13.1 U5.4)
D_IN3: SCH_PLC_Hieu (U3.27), D_Input (R17.1 U7.4)
D_IN4: SCH_PLC_Hieu (U3.26), D_Input (R21.1 U9.4)
D_IN5: SCH_PLC_Hieu (U3.25), D_Input (R27.1 U12.4)
D_IN6: SCH_PLC_Hieu (U3.24), D_Input (R31.1 U14.4)
D_IN7: SCH_PLC_Hieu (U3.23), D_Input (R10.1 U4.4)
D_IN8: SCH_PLC_Hieu (U3.22), D_Input (R14.1 U6.4)
D_IN9: SCH_PLC_Hieu (U3.21), D_Input (R19.1 U8.4)
D_IN10: SCH_PLC_Hieu (U3.20), D_Input (R24.1 U11.4)
D_IN11: SCH_PLC_Hieu (U3.15), D_Input (R23.1 U10.4)
D_IN12: SCH_PLC_Hieu (U3.14), D_Input (R29.1 U13.4)
D_OUT1: SCH_PLC_Hieu (U3.45), D_Output (R33.1)
D_OUT2: SCH_PLC_Hieu (U3.44), D_Output (R45.1)
D_OUT3: SCH_PLC_Hieu (U3.43), D_Output (R55.1)
D_OUT4: SCH_PLC_Hieu (U3.42), D_Output (R61.1)
D_OUT5: SCH_PLC_Hieu (U3.41), D_Output (R67.1)
D_OUT6: SCH_PLC_Hieu (U3.40), D_Output (R40.1)
D_OUT7: SCH_PLC_Hieu (U3.39), D_Output (R47.1)
D_OUT8: SCH_PLC_Hieu (U3.38), D_Output (R53.1)
D_OUT9: SCH_PLC_Hieu (U3.37), D_Output (R59.1)
D_OUT10: SCH_PLC_Hieu (U3.36), D_Output (R65.1)
D_OUT11: SCH_PLC_Hieu (U3.35), D_Output (R37.1)
D_OUT12: SCH_PLC_Hieu (U3.34), D_Output (R49.1)
DE: SCH_PLC_Hieu (U3.55), RS485 (R2.1 R3.1 U1.2 U1.3)
MCU_RX1: SCH_PLC_Hieu (U3.54), RS485 (R1.1 U1.1)
MCU_RX3: SCH_PLC_Hieu (U3.52), RS232 (IC1.12)
MCU_TX1: SCH_PLC_Hieu (U3.53), RS485 (R4.1 U1.4)
MCU_TX3: SCH_PLC_Hieu (U3.51), RS232 (IC1.11)
PWM_1: SCH_PLC_Hieu (U3.59), PWM_Output (R75.1)
PWM_2: SCH_PLC_Hieu (U3.58), PWM_Output (R78.1)
PWM_3: SCH_PLC_Hieu (U3.57), PWM_Output (R81.1)